# EAGLE design Sensor (EAGLE 7.6.0)
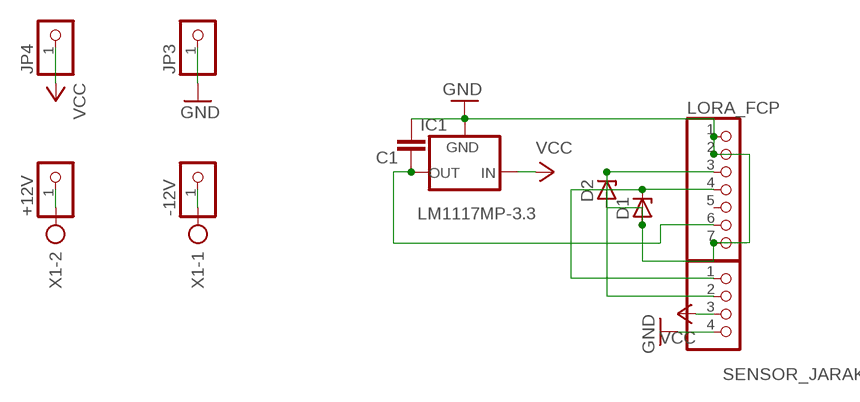
[diagram p0: schematic, sheet 1]

## Parts
+12V  PINHD-1X1  [1X01]
-12V  PINHD-1X1  [1X01]
C1  C-EU025-024X044  [C025-024X044]
D1  ZENER-DIODEDO35Z10  [DO35Z10]
D2  ZENER-DIODEDO35Z10  [DO35Z10]
IC1  LM1117MP-3.3  [SOT223]
JP3  PINHD-1X1  [1X01]
JP4  PINHD-1X1  [1X01]
LORA_FCP  PINHD-1X7  [1X07]
SENSOR_JARAK  PINHD-1X4  [1X04]
X1  AK300/2  [AK300/2]

## Nets
3.3: C1.2 IC1.2(OUT) IC1.4(OUT) LORA_FCP.6
GND: C1.1 D1.A D2.A IC1.1(GND) JP3.1 LORA_FCP.1 LORA_FCP.2 LORA_FCP.7 SENSOR_JARAK.4
GND12: -12V.1 X1.1
N$2: +12V.1 X1.2
RX: D2.C LORA_FCP.3 SENSOR_JARAK.2
TX: D1.C LORA_FCP.4 SENSOR_JARAK.1
VCC: IC1.3(IN) JP4.1 SENSOR_JARAK.3
Unconnected: LORA_FCP.5

## Library data of the parts
+12V -12V JP3 JP4 = pinhead:PINHD-1X1: PIN HEADER
C1 = rcl:C-EU: CAPACITOR, European symbol
D1 D2 = diode:ZENER-DIODE: Z-Diode
IC1 = lm1117:LM1117?-*: 800mA Low-Dropout Linear Regulator Source: http://ww1.microchip.com/downloads/en/DeviceDoc/39760d.pdf; MF: Texas Instruments; MPN: LM1117MP-3.3; OC_FARNELL: 9778195; OC_NEWARK: 28X3416
LORA_FCP = pinhead:PINHD-1X7: PIN HEADER
SENSOR_JARAK = pinhead:PINHD-1X4: PIN HEADER
X1 = con-ptr500:AK300/2: CONNECTOR; OC_FARNELL: unknown; OC_NEWARK: unknown

## Board
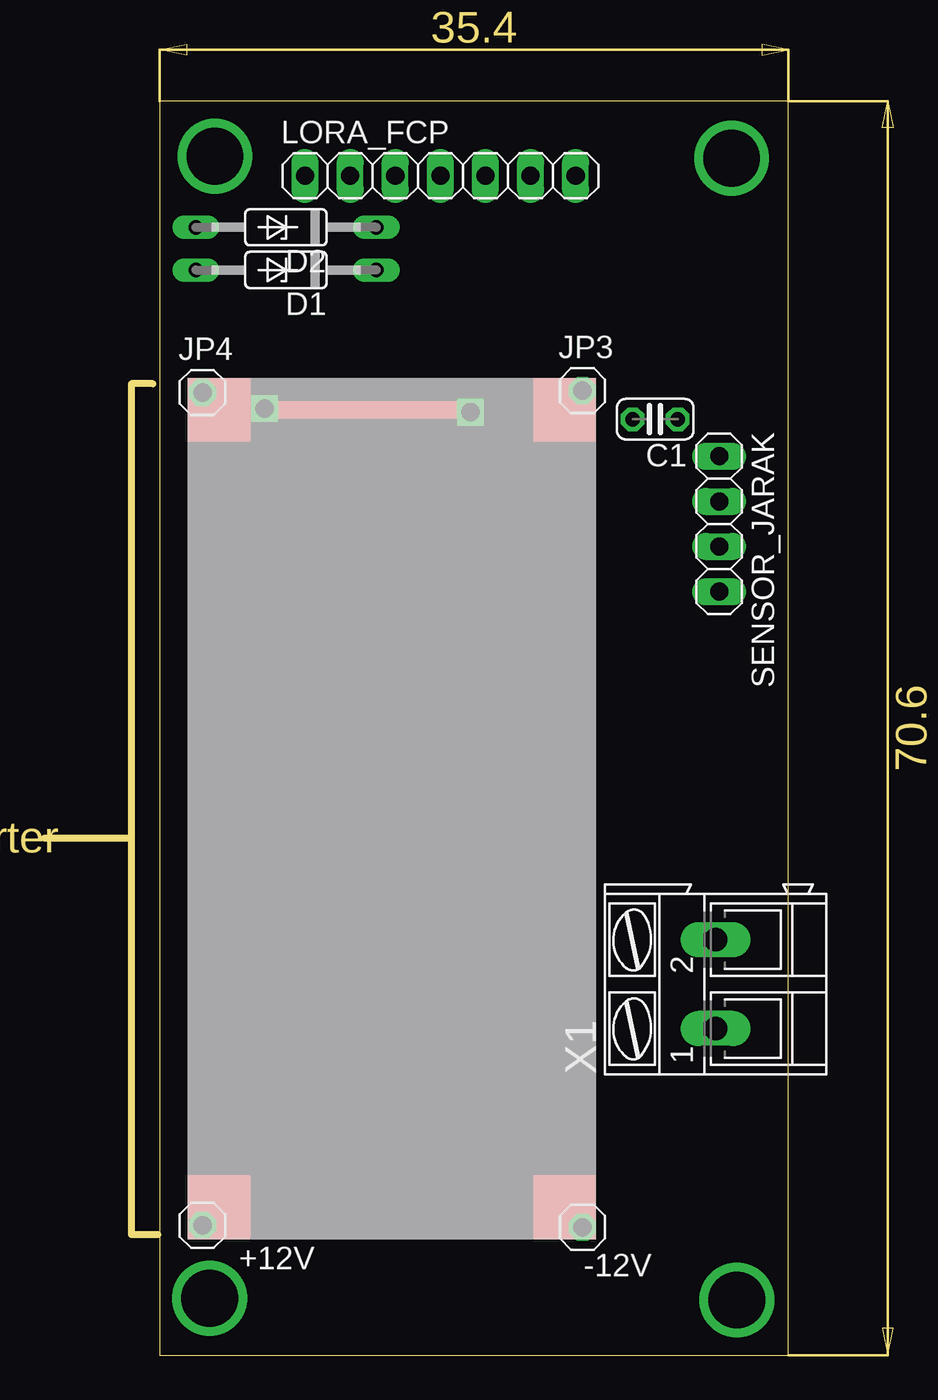
[diagram p1: board, top side]
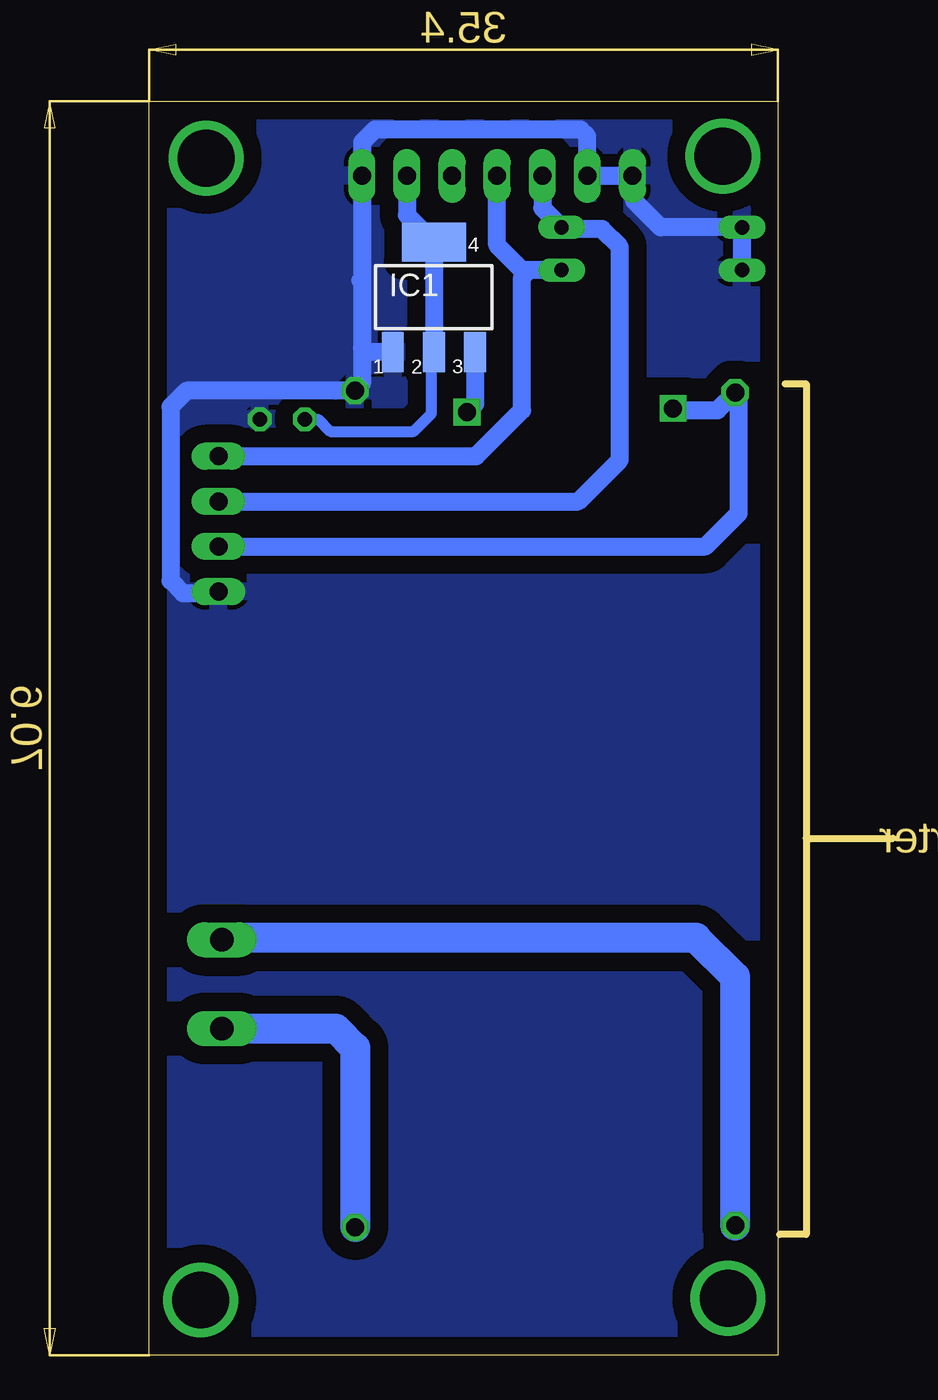
[diagram p2: board, bottom side, seen from below]

Size 41.9 x 70.6 mm. Coordinates in mm from the lower left corner, seen from the top.
Outline: 6.1,54.7 4.9,54.7 4.9,29.1
Outline: 4.9,29.1 4.9,6.8 6.4,6.8
Outline: 4.9,29.1 0,29.1
Outline: 6.5,0 41.9,0 41.9,70.6 6.5,70.6 6.5,0
Copper layers (1*16): Top 0.035mm / dielectric 1.5mm / Bottom 0.035mm
Design rules "default": minimum track width 10mil, minimum drill 24mil, track to track 8mil, track to pad 8mil, pad to pad 8mil, via to via 8mil, smd to smd 8mil, copper to edge 40mil, drill to drill 8mil, minimum pad ring 10mil, minimum via ring 8mil, stop-mask expansion 4mil, vias tented up to drill 0mil, thermal gap 10mil

### Footprints (pad centres in the part's own frame; a part is rotated, then mirrored left to right if it is on the bottom)
1X01 = drill 1.016 octagon: 1 0,0
C025-024X044 = drill 0.813 octagon: 1 -1.27,0; 2 1.27,0
DO35Z10 = drill 0.813 long: A 5.08,0; C -5.08,0
SOT223 = smd 1.219 x 2.235: 1 -2.311,-3.099; 2 0,-3.099; 3 2.311,-3.099 | smd 3.6 x 2.2: 4 0,3.099
1X07 = drill 1.016 long: 1 -7.62,0; 2 -5.08,0; 3 -2.54,0; 4 0,0; 5 2.54,0; 6 5.08,0; 7 7.62,0
1X04 = drill 1.016 long: 1 -3.81,0; 2 -1.27,0; 3 1.27,0; 4 3.81,0
AK300/2 = drill 1.321 long: 1 -2.515,0; 2 2.489,0

### Placement (x,y rotation side)
+12V  8.9,7.3 0 top
-12V  30.3,7.2 0 top
C1  34.4,52.7 180 top
D1  13.6,61.1 180 top
D2  13.6,63.5 180 top
IC1  25.86,59.57 0 bottom
JP3  30.3,54.3 0 top
JP4  8.9,54.2 0 top
LORA_FCP  22.3,66.4 0 top
SENSOR_JARAK  38,46.8 270 top
X1  37.8,20.9 90 top

### Tracks (layer width: path | path; a pad name or v marks a point on that pad's centre or on a via)
3.3
  Bottom 0.61: C1.2 32.4,52.7 31.7,52 27,52 26,53 26,56.33 IC1.2
  Bottom 1.016: LORA_FCP.6 27.38,64.19 IC1.4 IC1.2
GND
  Bottom 1.016: SENSOR_JARAK.4 38.09,42.9 40,42.9 40.7,43.6 40.7,53.4 39.8,54.3 JP3.1 29.92,54.68 29.92,56.7 | 29.92,60.4 LORA_FCP.7 29.9,66.42 29.9,68.3 29.2,69 17.6,69 17.22,68.62 LORA_FCP.2 LORA_FCP.1 14.6,66.32 14.6,65 13.1,63.5 D2.A D1.A | 30.02,60.5 29.92,60.4 | 29.92,60.4 29.92,56.7 | IC1.1 29.69,56.47 29.92,56.7
  pour Bottom (isolate 1.016): 6.1,70.9 42.1,70.9 41.9,-0.7 5.9,-0.7
GND12
  Bottom 1.676: X1.1 31.39,18.39 30.3,17.3 -12V.1
N$1  (via drill 3.2)
  other vias: 39,3.1
N$2
  Bottom 1.676: +12V.1 8.9,21.3 11.1,23.5 37.69,23.5 X1.2
N$3  (via drill 3.2)
  other vias: 9.6,67.5
N$4  (via drill 3.2)
  other vias: 38.7,67.4
N$5
  pour Bottom (isolate 1.016): 42.2,21.6 42.2,0.1 6.9,0.1 6.9,21.6
N$6  (via drill 3.2)
  other vias: 9.3,3.2
RX
  Bottom 1.016: LORA_FCP.3 19.76,64.58 D2.C 18.58,63.4 16.4,63.4 15.4,62.4 15.4,50.4 17.73,48.07 SENSOR_JARAK.2
TX
  Bottom 1.016: D1.C 20.5,61.1 | 20.5,61.1 20.9,61.1 22.3,62.5 LORA_FCP.4 | SENSOR_JARAK.1 23.49,50.61 20.9,53.2 20.9,60.7 20.5,61.1
VCC  (via drill 1)
  Top 1.016: v24,53.1 24.1,53.2 12.5,53.2 v12.4,53.3
  Bottom 1.016: SENSOR_JARAK.3 10.57,45.53 8.7,47.4 8.7,54 JP4.1 9.9,53.2 12.5,53.2 v12.4,53.3 | IC1.3 23.55,53.55 v24,53.1
(copper drawn outside any net)
  shapes: Top area x4

### Text on the board
Dimension: XL6019 Buck Boost Converter